# EAGLE design pk2c (EAGLE 5.11)
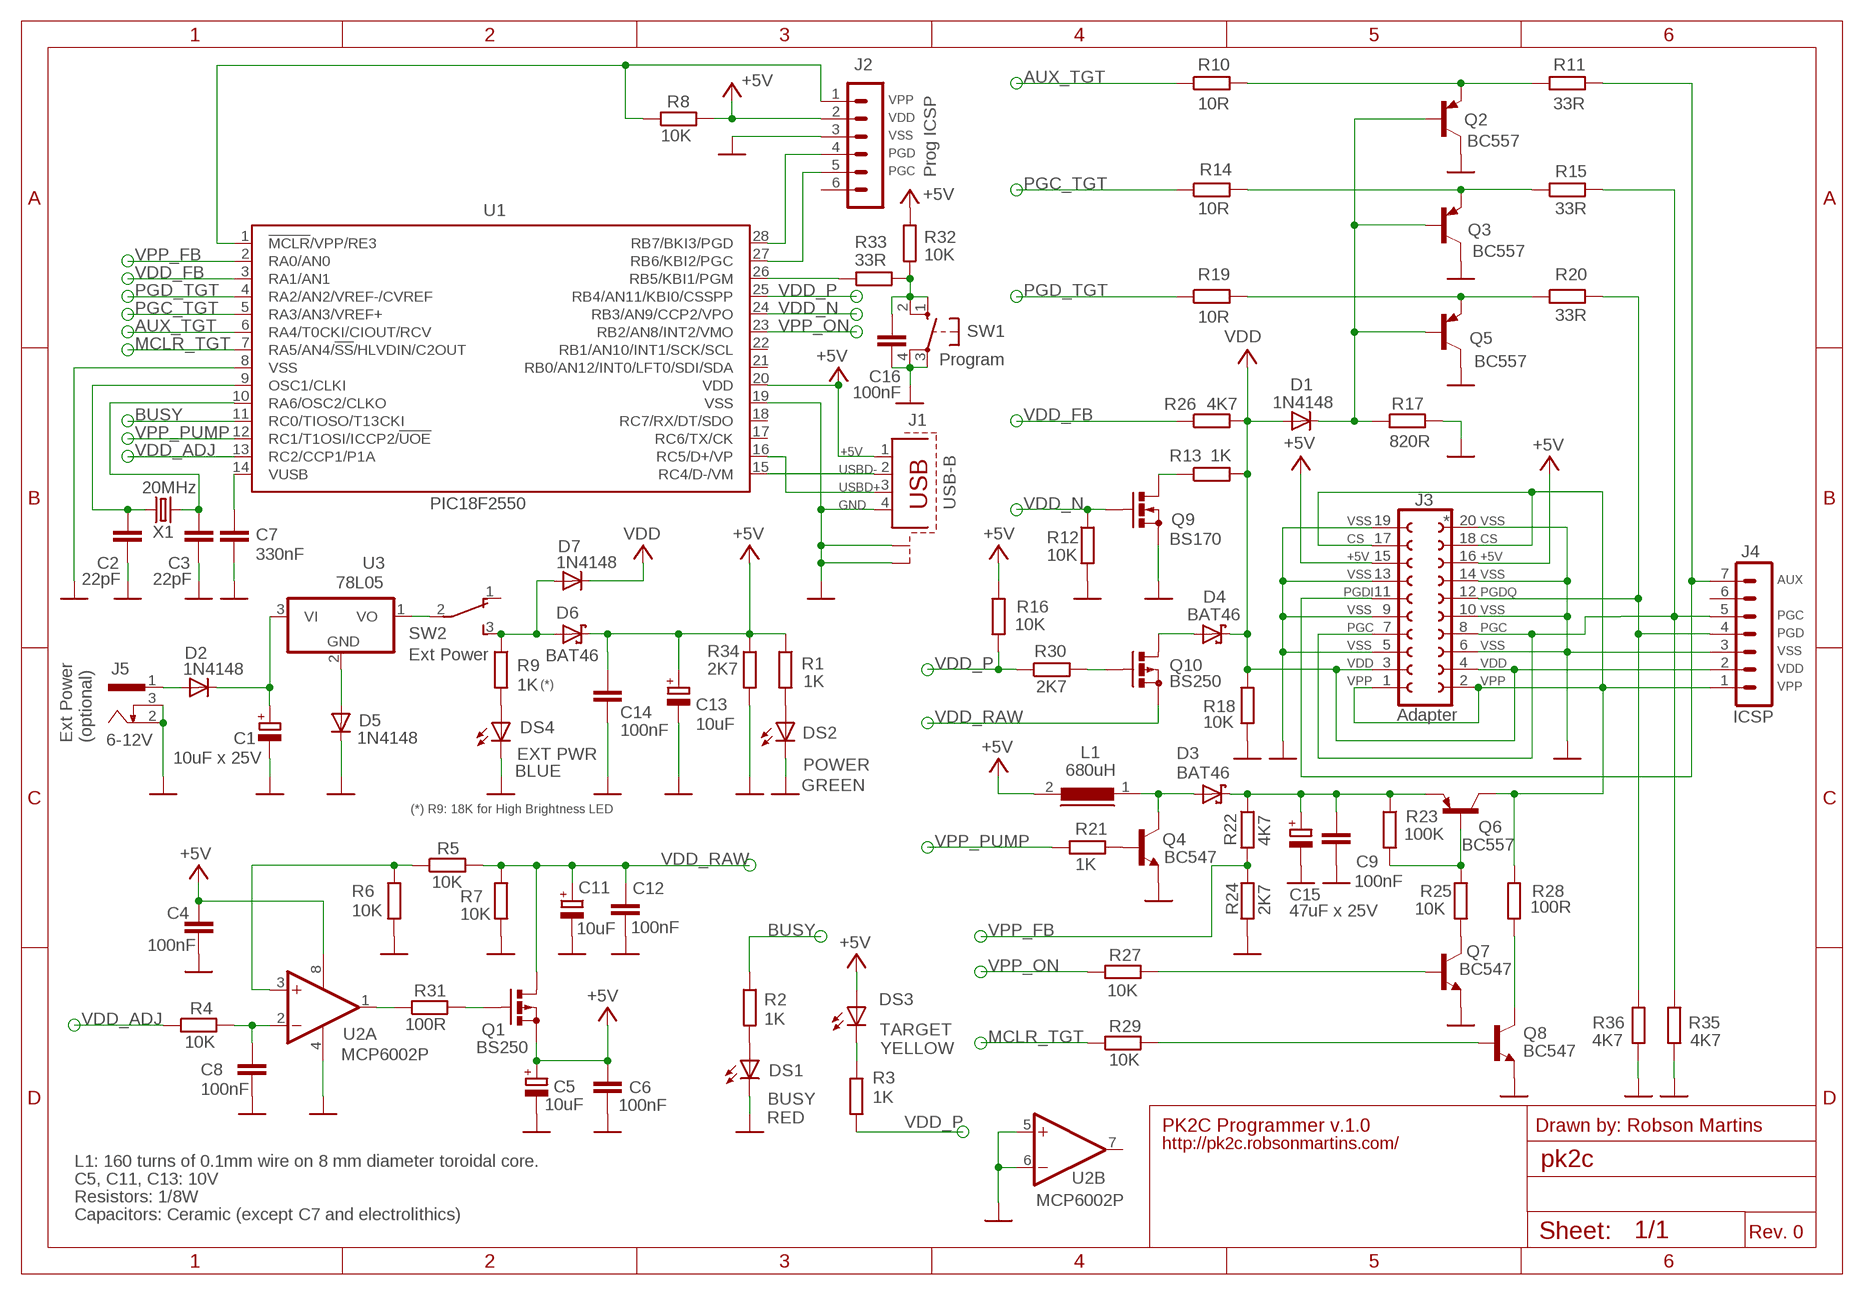
[diagram p0: schematic, sheet 1]

## Parts
C1  10uF x 25V  CPOL-EUE2,5-6E  [E2,5-6E]
C2  22pF  C-EU025-025X050  [C025-025X050]
C3  22pF  C-EU025-025X050  [C025-025X050]
C4  100nF  C-EU050-025X075  [C050-025X075]
C5  10uF  CPOL-EUE2,5-6E  [E2,5-6E]
C6  100nF  C-EU050-025X075  [C050-025X075]
C7  330nF  C-EU050-030X075  [C050-030X075]
C8  100nF  C-EU050-025X075  [C050-025X075]
C9  100nF  C-EU050-025X075  [C050-025X075]
C11  10uF  CPOL-EUE2,5-6E  [E2,5-6E]
C12  100nF  C-EU050-025X075  [C050-025X075]
C13  10uF  CPOL-EUE2,5-6E  [E2,5-6E]
C14  100nF  C-EU050-025X075  [C050-025X075]
C15  47uF x 25V  CPOL-EUE3.5-8  [E3,5-8]
C16  100nF  C-EU050-025X075  [C050-025X075]
D1  1N4148  1N4148DO35-7  [DO35-7]
D2  1N4148  1N4148DO35-7  [DO35-7]
D3  BAT46  BAT42  [DO35-7]
D4  BAT46  BAT42  [DO35-7]
D5  1N4148  1N4148DO35-7  [DO35-7]
D6  BAT46  BAT42  [DO35-7]
D7  1N4148  1N4148DO35-7  [DO35-7]
DS1  RED  LED3MM  [LED3MM]
DS2  GREEN  LED3MM  [LED3MM]
DS3  YELLOW  LED3MM  [LED3MM]
DS4  BLUE  LED3MM  [LED3MM]
J1  USB-B  PN61729-S  [PN61729-S]
J2  Prog ICSP  MA06-1  [MA06-1]
J3  Adapter  FE10-2  [FE10-2]
J4  ICSP  MA07-1  [MA07-1]
J5  6-12V  733980-62  [733980-62]
L1  680uH  A26GFC  [A26GFC]
Q1  BS250  [SOT54E]
Q2  BC557  [TO92]
Q3  BC557  [TO92]
Q4  BC547  [TO92]
Q5  BC557  [TO92]
Q6  BC557  [TO92]
Q7  BC547  [TO92]
Q8  BC547  [TO92]
Q9  BS170  [SOT54E]
Q10  BS250  [SOT54E]
R1  1K  R-EU_0204/7  [0204/7]
R2  1K  R-EU_0204/7  [0204/7]
R3  1K  R-EU_0204/7  [0204/7]
R4  10K  R-EU_0204/7  [0204/7]
R5  10K  R-EU_0204/7  [0204/7]
R6  10K  R-EU_0204/7  [0204/7]
R7  10K  R-EU_0204/7  [0204/7]
R8  10K  R-EU_0204/7  [0204/7]
R9  1K  R-EU_0204/7  [0204/7]
R10  10R  R-EU_0204/7  [0204/7]
R11  33R  R-EU_0204/7  [0204/7]
R12  10K  R-EU_0204/7  [0204/7]
R13  1K  R-EU_0204/7  [0204/7]
R14  10R  R-EU_0204/7  [0204/7]
R15  33R  R-EU_0204/7  [0204/7]
R16  10K  R-EU_0204/7  [0204/7]
R17  820R  R-EU_0204/7  [0204/7]
R18  10K  R-EU_0204/7  [0204/7]
R19  10R  R-EU_0204/7  [0204/7]
R20  33R  R-EU_0204/7  [0204/7]
R21  1K  R-EU_0204/7  [0204/7]
R22  4K7  R-EU_0204/7  [0204/7]
R23  100K  R-EU_0204/7  [0204/7]
R24  2K7  R-EU_0204/7  [0204/7]
R25  10K  R-EU_0204/7  [0204/7]
R26  4K7  R-EU_0204/7  [0204/7]
R27  10K  R-EU_0204/7  [0204/7]
R28  100R  R-EU_0204/7  [0204/7]
R29  10K  R-EU_0204/7  [0204/7]
R30  2K7  R-EU_0204/7  [0204/7]
R31  100R  R-EU_0204/7  [0204/7]
R32  10K  R-EU_0204/7  [0204/7]
R33  33R  R-EU_0204/7  [0204/7]
R34  2K7  R-EU_0204/7  [0204/7]
R35  4K7  R-EU_0204/7  [0204/7]
R36  4K7  R-EU_0204/7  [0204/7]
SW1  Program  10-XX  [B3F-10XX]
SW2  Ext Power  TL36PO  [TL3XPO]
U1  PIC18F2550  PIC18F2550_28DIP  [DIL28-3]
U2  MCP6002P  MCP602P  [DIL08]
U3  78L05  78L05Z  [TO92]
X1  20MHz  CRYSTALHC49U-V  [HC49U-V]

## Nets
+5V: C4.1 C5.+ C6.1 C13.+ C14.1 D6.C DS3.A J1.1 J2.2 J3.15 J3.16 L1.2 Q1.S R1.1 R8.2 R16.1 R32.1 R34.1 U1.20(VDD) U2.8(P:V+)
+EXT_PWR: D2.A J5.1
+EXT_PWR_5V: SW2.2(P) U3.1(VO)
+EXT_PWR_NR: C1.+ D2.C U3.3(VI)
+EXT_PWR_ON: D6.A D7.A R9.1 SW2.3(S)
AUX: J3.11 J4.7 R11.2
AUX_COMP: Q2.1(E) R10.2 R11.1
AUX_TGT: R10.1 U1.6(RA4/T0CKI/CIOUT/RCV)
BUSY: R2.1 U1.11(RC0/TIOSO/T13CKI)
CAP_VUSB: C7.1 U1.14(VUSB)
GND: C1.- C2.1 C3.1 C4.2 C5.- C6.2 C7.2 C8.2 C9.2 C11.- C12.2 C13.- C14.2 C15.- C16.2 D5.C DS1.K(C) DS2.K(C) DS4.K(C) J1.4 J1.S1 J1.S2 J2.3 J3.5 J3.6 J3.9 J3.10 J3.13 J3.14 J3.19 J3.20 J4.3 J5.2 J5.3 Q2.3(C) Q3.3(C) Q4.1(E) Q5.3(C) Q7.1(E) Q8.1(E) Q9.S R6.2 R7.2 R12.2 R17.2 R18.2 R24.2 R34.2 R35.2 R36.2 SW1.3(P) SW1.4(P1) U1.8(VSS) U1.19(VSS) U2.4(P:V-) U2.5(B:+IN) U2.6(B:-IN)
ICSP_PGC: J2.5 U1.27(RB6/KBI2/PGC)
ICSP_PGD: J2.4 U1.28(RB7/BKI3/PGD)
ICSP_VPP: J2.1 R8.1 U1.1(!MCLR!/VPP/RE3)
MCLR_TGT: R29.1 U1.7(RA5/AN4/!SS!/HLVDIN/C2OUT)
N$1: D5.A U3.2(GND)
N$3: C16.1 R32.2 R33.2 SW1.1(S) SW1.2(S1)
N$5: DS4.A R9.2
N$10: DS2.A R1.2
N$11: DS1.A R2.2
N$12: DS3.K(C) R3.1
N$15: R31.1 U2.1(A:OUT)
N$17: Q1.G R31.2
N$18: Q7.3(C) R25.2
N$22: Q9.D R13.1
N$23: D4.A Q10.D
N$25: Q10.G R30.2
N$29: Q4.2(B) R21.2
N$31: Q6.2(B) R23.2 R25.1
N$33: Q8.3(C) R28.2
N$34: Q7.2(B) R27.2
N$36: Q8.2(B) R29.2
OSC1: C2.2 U1.9(OSC1/CLKI) X1.1
OSC2: C3.2 U1.10(RA6/OSC2/CLKO) X1.2
PGC: J3.7 J3.8 J4.5 R15.2 R35.1
PGC_COMP: Q3.1(E) R14.2 R15.1
PGC_TGT: R14.1 U1.5(RA3/AN3/VREF+)
PGD: J3.12 J4.4 R20.2 R36.1
PGD_COMP: Q5.1(E) R19.2 R20.1
PGD_TGT: R19.1 U1.4(RA2/AN2/VREF-/CVREF)
SW_PROGRAM: R33.1 U1.26(RB5/KBI1/PGM)
USBD+: J1.3 U1.16(RC5/D+/VP)
USBD-: J1.2 U1.15(RC4/D-/VM)
VDD: D1.A D4.C D7.C J3.3 J3.4 J4.2 R13.2 R18.1 R26.2
VDD_ADJ: R4.1 U1.13(RC2/CCP1/P1A)
VDD_COMP: D1.C Q2.2(B) Q3.2(B) Q5.2(B) R17.1
VDD_FB: R26.1 U1.3(RA1/AN1)
VDD_N: Q9.G R12.1 U1.24(RB3/AN9/CCP2/VPO)
VDD_P: R3.2 R16.2 R30.1 U1.25(RB4/AN11/KBI0/CSSPP)
VDD_RAW: C11.+ C12.1 Q1.D Q10.S R5.2 R7.1
VDD_RAW_FB: R5.1 R6.1 U2.3(A:+IN)
VDD_RAW_REF: C8.1 R4.2 U2.2(A:-IN)
VPP: J3.1 J3.2 J3.17 J3.18 J4.1 Q6.3(C) R28.1
VPP_FB: R22.2 R24.1 U1.2(RA0/AN0)
VPP_ON: R27.1 U1.23(RB2/AN8/INT2/VMO)
VPP_PUMP: R21.1 U1.12(RC1/T1OSI/ICCP2/!UOE)
VPP_PUMP_SW: D3.A L1.1 Q4.3(C)
VPP_RAW: C9.1 C15.+ D3.C Q6.1(E) R22.1 R23.1
Unconnected: J2.6 J4.6 SW2.1(O) U1.17(RC6/TX/CK) U1.18(RC7/RX/DT/SDO) U1.21(RB0/AN12/INT0/LFT0/SDI/SDA) U1.22(RB1/AN10/INT1/SCK/SCL) U2.7(B:OUT)

## Notes on the sheet
- VPP
- VDD
- VSS
- PGD
- PGC
- VSS | * | VSS
- CS | CS
- +5V | +5V
- VSS | VSS
- AUX
- PGDI | PGDQ
- VSS | VSS
- PGC
- PGC | PGC
- PGD
- VSS | VSS
- VSS
- VDD | VDD
- VDD
- (*) | VPP | VPP
- VPP
- Ext Power | (optional)
- EXT PWR
- POWER
- (*) R9: 18K for High Brightness LED
- TARGET
- BUSY
- PK2C Programmer v.1.0 | Drawn by: Robson Martins
- http://pk2c.robsonmartins.com/
- L1: 160 turns of 0.1mm wire on 8 mm diameter toroidal core.
- C5, C11, C13: 10V
- Resistors: 1/8W
- Capacitors: Ceramic (except C7 and electrolithics)
- Rev. 0

## Library data of the parts
C1 C5 C11 C13 C15 = rcl:CPOL-EU: POLARIZED CAPACITOR, European symbol
C2-C4 C6-C9 C12 C14 C16 = rcl:C-EU: CAPACITOR, European symbol
D1 D2 D5 D7 = diode:1N4148: DIODE high speed (Philips)
D3 D4 D6 = diode:BAT42: DIODE barrier diode
DS1-DS4 = led:LED: LED OSRAM: - CHIPLED LG R971, LG N971, LY N971, LG Q971, LY Q971, LO R971, LY R971 LH N974, LH R974 LS Q976, LO Q976, LY Q976 LO Q996 - Hyper CHIPLED LW Q18S LB Q993, LB Q99A, LB R99A - SideLED LS A670, LO A670, LY A670, LG A670, LP A670 LB A673, LV A673, LT A673, LW A673 LH A674 LY A675 LS A676, LA A676, LO A676, LY A676, LW A676 LS A679, LY A679, LG A679 - Hyper Micro SIDELED® LS Y876, LA Y876, LO Y876, LY Y876 LT Y87S - SmartLED LW L88C, LW L88S LB L89C, LB L89S, LG L890 LS L89K, LO L89K, LY L89K LS L896, LA L896, LO L896, LY L896 - TOPLED LS T670, LO T670, LY T670, LG T670, LP T670 LSG T670, LSP T670, LSY T670, LOP T670, LYG T670 LG T671, LOG T671, LSG T671 LB T673, LV T673, LT T673, LW T673 LH T674 LS T676, LA T676, LO T676, LY T676, LB T676, LH T676, LSB T676, LW T676 LB T67C, LV T67C, LT T67C, LS T67K, LO T67K, LY T67K, LW E67C LS E67B, LA E67B, LO E67B, LY E67B, LB E67C, LV E67C, LT E67C LW T67C LS T679, LY T679, LG T679 LS T770, LO T770, LY T770, LG T770, LP T770 LB T773, LV T773, LT T773, LW T773 LH T774 LS E675, LA E675, LY E675, LS T675 LS T776, LA T776, LO T776, LY T776, LB T776 LHGB T686 LT T68C, LB T68C - Hyper Mini TOPLED® LB M676 - Mini TOPLED Santana® LG M470 LS M47K, LO M47K, LY M47K Source: http://www.osram.convergy.de LUXEON: - LUMILED® LXK2-PW12-R00, LXK2-PW12-S00, LXK2-PW14-U00, LXK2-PW14-V00 LXK2-PM12-R00, LXK2-PM12-S00, LXK2-PM14-U00 LXK2-PE12-Q00, LXK2-PE12-R00, LXK2-PE12-S00, LXK2-PE14-T00, LXK2-PE14-U00 LXK2-PB12-K00, LXK2-PB12-L00, LXK2-PB12-M00, LXK2-PB14-N00, LXK2-PB14-P00, LXK2-PB14-Q00 LXK2-PR12-L00, LXK2-PR12-M00, LXK2-PR14-Q00, LXK2-PR14-R00 LXK2-PD12-Q00, LXK2-PD12-R00, LXK2-PD12-S00 LXK2-PH12-R00, LXK2-PH12-S00 LXK2-PL12-P00, LXK2-PL12-Q00, LXK2-PL12-R00 Source: www.luxeon.com KINGBRIGHT: KA-3528ASYC Source: www.kingbright.com
J1 = con-berg:PN61729-S: BERG USB connector; OC_FARNELL: unknown; OC_NEWARK: unknown
J2 = con-lstb:MA06-1: PIN HEADER; OC_FARNELL: unknown; OC_NEWARK: unknown
J3 = con-lsta:FE10-2: FEMALE HEADER; OC_FARNELL: unknown; OC_NEWARK: unknown
J4 = con-lstb:MA07-1: PIN HEADER; OC_FARNELL: unknown; OC_NEWARK: unknown
J5 = con-conrad:73398?: FEMALE PRINT CONNECTOR Niedervolt-Steckverbinder Distributor Conrad
L1 = inductors:A26GFC: INDUCTOR
Q1 Q10 = transistor-small-signal:BS250: P-CHANNEL MOS FET
Q2 Q3 Q5 Q6 = transistor-pnp:BC557: PNP Transistor
Q4 Q7 Q8 = transistor:BC547: NPN TRANSISTOR
Q9 = transistor-small-signal:BS170: N-CHANNEL MOS FET
R1-R36 = resistor:R-EU_: RESISTOR, European symbol
SW1 = switch-omron:10-XX: OMRON SWITCH; MPN: B3F-1000; OC_FARNELL: 176432; OC_NEWARK: 36M3542
SW2 = switch:TL36PO: TINY SWITCH ON - ON Source: http://www2.produktinfo.conrad.com/datenblaetter/700000-724999/705152-da-01-de-Subminiaturschalter_TL_36YO.pdf
U1 = microchip:PIC18F2*_28: USB Microcontrollers with nanoWatt Technology High-Performance, Enhanced Flash, 28/40/44-Pin, Source: http://ww1.microchip.com/downloads/en/devicedoc/39632c.pdf; MF: MICROCHIP; MPN: PIC18F2550-I/SP; OC_FARNELL: 1523822; OC_NEWARK: 80K6054
U2 = linear:MCP602: Single Op Amp 2.7V to 6.0V Single Supply CMOS Source: http://ww1.microchip.com/downloads/en/DeviceDoc/21314g.pdf
U3 = linear:78*: Positive VOLTAGE REGULATOR Source: http://cache.national.com/ds/LM/LM78L05.pdf http://www.fairchildsemi.com/ds/LM/LM7805.pdf
X1 = crystal:CRYSTAL: CRYSTAL; OC_FARNELL: 1666969; OC_NEWARK: unknown

## Board
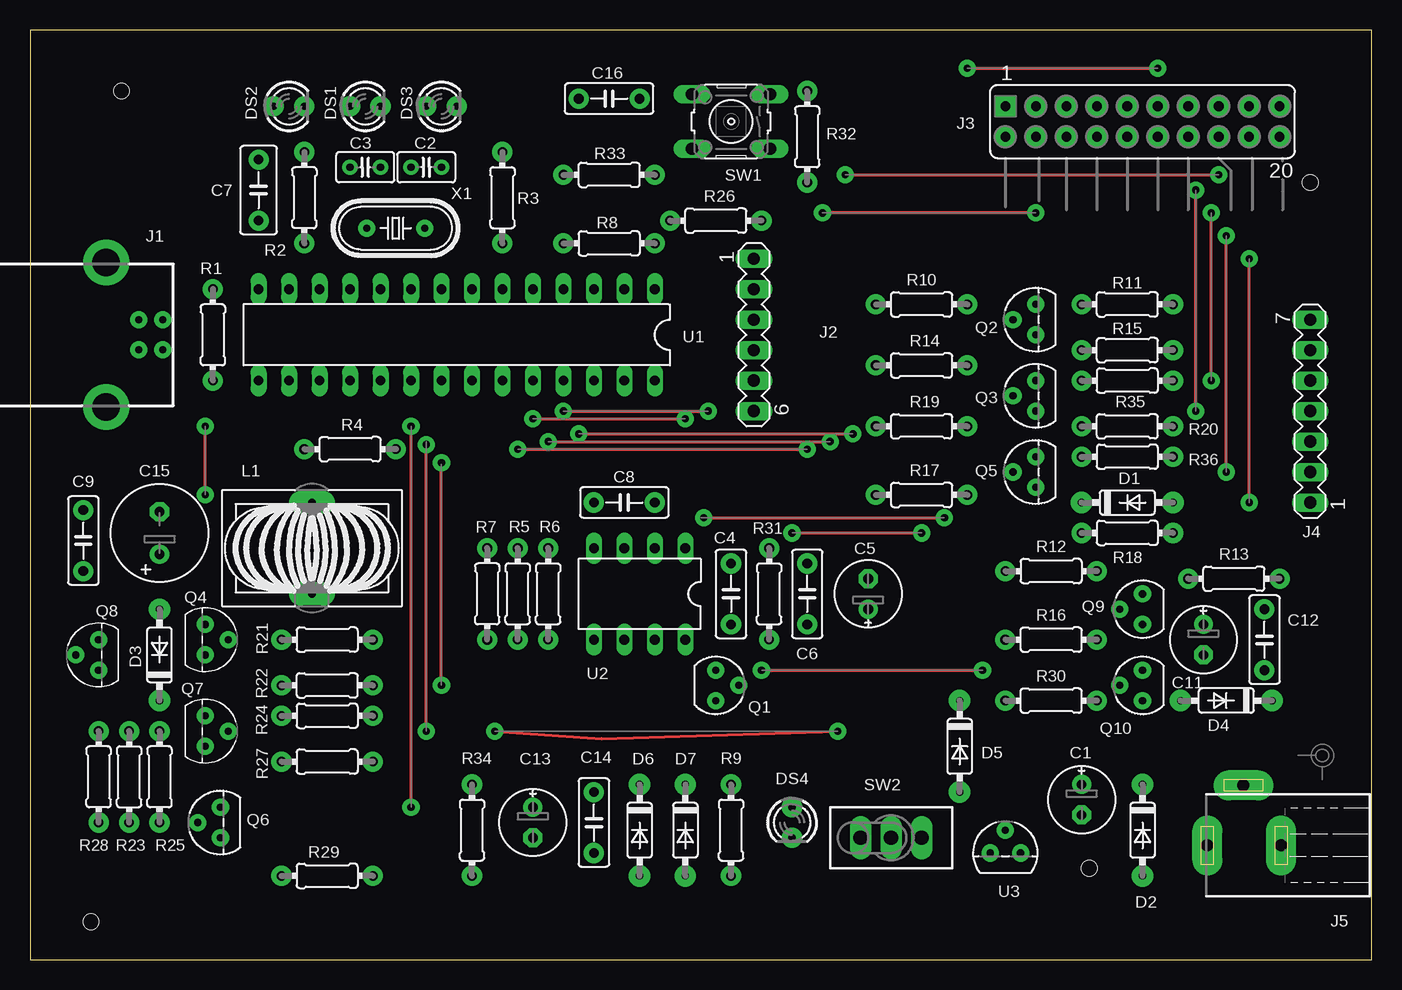
[diagram p1: board, top side]
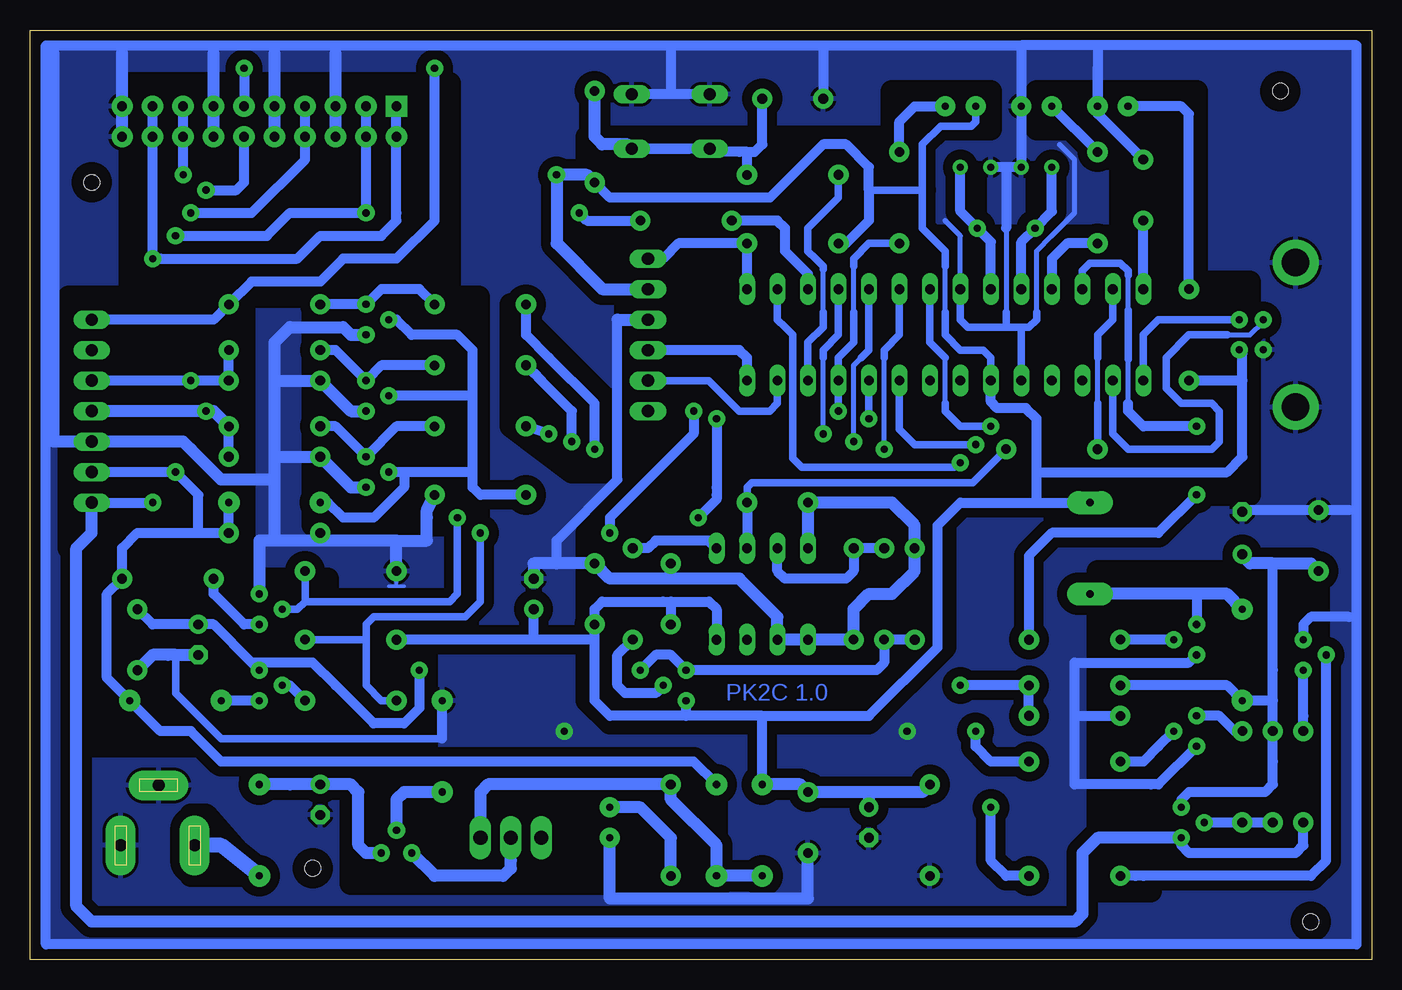
[diagram p2: board, bottom side, seen from below]

Size 111.82 x 77.48 mm. Coordinates in mm from the lower left corner, seen from the top.
Outline: 0,0 111.82,0.01 111.82,77.47 0,77.47 0,0
Copper layers (1*16): Top 0.035mm / dielectric 1.5mm / Bottom 0.035mm
Design rules "default": minimum track width 10mil, minimum drill 24mil, track to track 8mil, track to pad 8mil, pad to pad 8mil, via to via 8mil, smd to smd 8mil, copper to edge 40mil, drill to drill 8mil, minimum pad ring 10mil, minimum via ring 8mil, stop-mask expansion 4mil, vias tented up to drill 0mil, thermal gap 10mil
Holes 1.3 mm at 7.62,72.39 106.68,64.77 5.08,3.17 88.27,7.62
bRestrict: area 74.4,36.2 to 88.3,55.2; area 94,31.8 to 108.6,55.2; area 4.4,5.7 to 22.9,32.4; area 35.6,19.7 to 65.4,39.4; area 54.6,6.3 to 85.1,14; area 78.7,17.8 to 108,31.8; area 10.2,38.7 to 65.4,72.4; area 76.8,55.2 to 103.5,73; area 92.7,7 to 98.4,12.1; area 63.5,40.6 to 71.8,54.6

### Footprints (pad centres in the part's own frame; a part is rotated, then mirrored left to right if it is on the bottom)
E2,5-6E = drill 0.813 pad 1.575 round: + -1.27,0 | drill 0.813 pad 1.575 octagon: - 1.27,0
C025-025X050 = drill 0.6 pad 1.27 round: 1 -1.27,0; 2 1.27,0
C050-025X075 = drill 0.813 pad 1.676 round: 1 -2.54,0; 2 2.54,0
C050-030X075 = drill 0.813 pad 1.676 round: 1 -2.54,0; 2 2.54,0
E3,5-8 = drill 0.813 pad 1.6 round: + -1.778,0 | drill 0.813 pad 1.6 octagon: - 1.778,0
DO35-7 = drill 0.6 pad 1.778 round: A 3.81,0; C -3.81,0
LED3MM = drill 0.6 pad 1.676 round: A -1.27,0; K 1.27,0
PN61729-S = drill 0.6 pad 1.422 round: 1 1.25,4.71; 2 -1.25,4.71; 3 -1.25,2.71; 4 1.25,2.71 | drill 2.3 pad 3.81 round: S1 -6.02,0; S2 6.02,0
MA06-1 = drill 1.016 long: 1 -6.35,0; 2 -3.81,0; 3 -1.27,0; 4 1.27,0; 5 3.81,0; 6 6.35,0
FE10-2 = drill 0.8 pad 1.778 square: 1 -11.43,1.27 | drill 0.8 pad 1.778 round: 2 -11.43,-1.27; 3 -8.89,1.27; 4 -8.89,-1.27; 5 -6.35,1.27; 6 -6.35,-1.27; 7 -3.81,1.27; 8 -3.81,-1.27; 9 -1.27,1.27; 10 -1.27,-1.27; 11 1.27,1.27; 12 1.27,-1.27; 13 3.81,1.27; 14 3.81,-1.27; 15 6.35,1.27; 16 6.35,-1.27; 17 8.89,1.27; 18 8.89,-1.27; 19 11.43,1.27; 20 11.43,-1.27
MA07-1 = drill 1.016 long: 1 -7.62,0; 2 -5.08,0; 3 -2.54,0; 4 0,0; 5 2.54,0; 6 5.08,0; 7 7.62,0
733980-62 = drill 1 pad 2.5 long: 1 0,8.57; 2 0,2.42; 3 5,5.57
A26GFC = drill 0.6 pad 1.93 long: 1 0,3.81; 2 0,-3.81
SOT54E = drill 0.6 pad 1.422 round: D -1.27,0; G 0,1.905; S 1.27,0
TO92 = drill 0.6 pad 1.422 round: 1 1.27,0; 2 0,1.905; 3 -1.27,0
0204/7 = drill 0.813 pad 1.676 round: 1 -3.81,0 | drill 0.8 pad 1.676 round: 2 3.81,0
B3F-10XX = drill 1.016 long: 1 -3.251,2.261; 2 3.251,2.261; 3 -3.251,-2.261; 4 3.251,-2.261
TL3XPO = drill 1.2 pad 1.27 long: 1 -2.54,0; 2 0,0; 3 2.54,0
DIL28-3 = drill 0.813 long: 1 -16.51,-3.81; 2 -13.97,-3.81; 3 -11.43,-3.81; 4 -8.89,-3.81; 5 -6.35,-3.81; 6 -3.81,-3.81; 7 -1.27,-3.81; 8 1.27,-3.81; 9 3.81,-3.81; 10 6.35,-3.81; 11 8.89,-3.81; 12 11.43,-3.81; 13 13.97,-3.81; 14 16.51,-3.81; 15 16.51,3.81; 16 13.97,3.81; 17 11.43,3.81; 18 8.89,3.81; 19 6.35,3.81; 20 3.81,3.81; 21 1.27,3.81; 22 -1.27,3.81; 23 -3.81,3.81; 24 -6.35,3.81; 25 -8.89,3.81; 26 -11.43,3.81; 27 -13.97,3.81; 28 -16.51,3.81
DIL08 = drill 0.813 long: 1 -3.81,-3.81; 2 -1.27,-3.81; 3 1.27,-3.81; 4 3.81,-3.81; 5 3.81,3.81; 6 1.27,3.81; 7 -1.27,3.81; 8 -3.81,3.81
TO92' = drill 0.6 pad 1.422 round: 1 -1.27,0; 2 0,1.905; 3 1.27,0
HC49U-V = drill 0.6 pad 1.422 round: 1 -2.413,0; 2 2.413,0

### Placement (x,y rotation side)
C1  87.63,13.34 270 top
C2  33.02,66.04 0 top
C3  27.94,66.04 180 top
C4  58.42,30.48 90 top
C5  69.85,30.48 90 top
C6  64.77,30.48 90 top
C7  19.05,64.14 90 top
C8  49.53,38.1 180 top
C9  4.45,34.92 90 top
C11  97.79,26.67 270 top
C12  102.87,26.67 270 top
C13  41.91,11.43 270 top
C14  46.99,11.43 270 top
C15  10.79,35.56 90 top
C16  48.26,71.75 180 top
D1  91.44,38.1 0 top
D2  92.71,10.79 270 top
D3  10.79,25.4 90 top
D4  99.69,21.59 180 top
D5  77.47,17.78 270 top
D6  50.8,10.79 270 top
D7  54.61,10.79 270 top
DS1  27.94,71.12 0 top
DS2  21.59,71.12 0 top
DS3  34.29,71.12 0 top
DS4  63.5,11.43 270 top
J1  6.35,52.07 270 top
J2  60.33,52.07 270 top
J3  92.71,69.85 0 top
J4  106.68,45.72 90 top
J5  106.68,9.53 90 top
L1  23.5,34.29 180 top
Q1  57.15,22.86 270 top
Q2  83.82,53.34 90 top
Q3  83.82,46.99 90 top
Q4  14.61,26.67 270 top
Q5  83.82,40.64 90 top
Q6  15.88,11.43 90 top
Q7  14.61,19.05 270 top
Q8  5.71,25.4 90 top
Q9  92.71,29.21 90 top
Q10  92.71,22.86 90 top
R1  15.24,52.07 90 top
R2  22.86,63.5 90 top
R3  39.37,63.5 270 top
R4  26.67,42.55 0 top
R5  40.64,30.48 270 top
R6  43.18,30.48 270 top
R7  38.1,30.48 90 top
R8  48.26,59.69 180 top
R9  58.42,10.79 270 top
R10  74.3,54.61 0 top
R11  91.44,54.61 0 top
R12  85.09,32.38 180 top
R13  100.33,31.75 0 top
R14  74.3,49.53 0 top
R15  91.44,50.8 0 top
R16  85.09,26.67 0 top
R17  74.3,38.73 0 top
R18  91.44,35.56 180 top
R19  74.3,44.45 0 top
R20  91.44,44.45 0 top
R21  24.77,26.67 180 top
R22  24.77,22.86 0 top
R23  8.26,15.24 270 top
R24  24.77,20.32 180 top
R25  10.79,15.24 90 top
R26  57.15,61.59 0 top
R27  24.77,16.51 180 top
R28  5.71,15.24 90 top
R29  24.77,6.99 180 top
R30  85.09,21.59 0 top
R31  61.59,30.48 270 top
R32  64.77,68.58 90 top
R33  48.26,65.41 0 top
R34  36.83,10.79 270 top
R35  91.44,48.26 180 top
R36  91.44,41.91 180 top
SW1  58.42,69.85 180 top
SW2  71.75,10.16 0 top
U1  35.56,52.07 180 top
U2  50.8,30.48 180 top
U3  78L05  [TO92']  81.28,8.89 0 top
X1  30.48,60.96 180 top

### Tracks (layer width: path | path; a pad name or v marks a point on that pad's centre or on a via)
+5V  (via drill 0.6 pad 1.42)
  Top 0.254: v67.94,65.41 v99.06,65.41
  Bottom 0.406: 35.56,53.98 35.56,57.78
  Bottom 0.61: U1.20 31.75,50.16 32.38,50.8 34.29,50.8 35.56,52.07 35.56,53.98 | 35.56,57.78 35.56,59.05 37.47,60.96 37.47,64.14 | 37.47,64.14 41.91,64.14 | 37.47,64.14 37.47,67.94 35.94,69.47 33.4,69.47 33.02,69.85 DS3.A
  Bottom 0.813: 64.77,26.67 C6.1 64.77,29.21 64.14,29.84 59.05,29.84 58.42,29.84 | 58.42,29.84 C4.1 | U2.8 54.61,29.21 55.24,29.84 58.42,29.84 | 57.15,20.32 Q1.S | 57.15,20.32 63.5,20.32 64.77,21.59 64.77,26.67 | 64.77,26.67 69.85,26.67 | 69.85,26.67 R16.1 | 10.79,48.26 10.79,50.55 J1.1 | 10.79,48.26 R1.1 | J3.15 J3.16 v99.06,65.41 | 27.94,40.64 27.94,45.09 28.83,45.97 31.24,45.97 31.75,46.48 U1.20 | 10.79,48.26 10.79,41.91 12.06,40.64 27.94,40.64 | 69.85,26.67 C5.+ | 27.94,38.1 27.94,40.64 | 27.94,38.1 34.29,38.1 36.2,36.2 36.2,26.04 41.91,20.32 50.8,20.32 | 50.8,20.32 57.15,20.32 | D6.C 50.8,20.32 | R32.1 63.5,63.5 50.16,63.5 45.72,67.94 43.81,67.94 41.91,66.04 41.91,64.14 41.91,62.87 41.91,62.23 41.91,61.59 43.81,59.69 R8.2 | 27.94,38.1 L1.2
  Bottom 1.016: D6.C 47.62,14.61 C14.1 41.91,13.97 | 41.91,13.97 37.47,13.97 R34.1 | 41.91,13.97 C13.+ | R32.1 65.41,65.41 v67.94,65.41 67.94,59.69 64.14,55.88 J2.2
+EXT_PWR
  Bottom 1.27: J5.1 95.89,9.53 D2.A
+EXT_PWR_5V
  Bottom 1.016: U3.1 78.11,6.99 72.39,6.99 71.75,7.62 71.75,8.26 SW2.2
+EXT_PWR_NR
  Bottom 1.016: D2.C 90.17,14.61 C1.+ 85.09,14.61 84.45,13.97 84.45,9.53 83.82,8.89 U3.3
+EXT_PWR_ON
  Bottom 1.016: D6.A D7.A 54.61,9.53 58.42,13.34 R9.1 73.66,14.61 74.3,13.97 SW2.3
AUX  (via drill 0.6 pad 1.42)
  Top 0.254: v78.11,74.3 v93.98,74.3
  Bottom 0.813: J4.7 96.52,53.34 R11.2 93.34,56.52 87.63,56.52 85.72,58.42 81.28,58.42 78.11,61.59 78.11,72.39 v78.11,74.3 | v93.98,74.3 J3.11
AUX_COMP
  Bottom 0.813: R11.1 Q2.1 82.55,55.88 80.64,55.88 79.38,55.88 R10.2
AUX_TGT  (via drill 0.6 pad 1.42)
  Top 0.254: v40.64,42.55 v64.77,42.55
  Bottom 0.406: 40.64,50.16 40.64,46.99 40.64,45.72 v40.64,42.55
  Bottom 0.61: U1.6 39.37,52.07 40.64,50.8 40.64,50.16
  Bottom 0.813: R10.1 70.48,52.07 68.58,50.16 64.77,46.35 v64.77,42.55
BUSY
  Bottom 0.813: U1.11 26.67,58.42 25.4,59.69 R2.1
CAP_VUSB
  Bottom 0.813: U1.14 C7.1
GND  (via drill 0.6 pad 1.42)
  Top 0.254: v67.31,19.05 47.62,18.41 v38.73,19.05
  Bottom 0.305: 81.28,31.11 81.92,31.11 | 80.64,31.11 81.28,31.11 | 81.28,31.11 R12.2
  Bottom 0.406: 30.48,60.96 30.48,53.98 | 27.94,54.61 27.94,53.98 27.94,54.61 | 27.94,54.61 27.94,59.05 26.67,60.33 24.77,62.23 24.77,66.67 26.04,67.94 | U1.8 34.29,60.33 35.56,61.59 | 1.91,28.57 1.27,28.57 1.27,27.94 | 1.91,37.47 1.27,37.47 1.27,38.1
  Bottom 0.61: U1.19 29.21,51.44 29.21,52.7 | 30.48,52.7 33.66,52.7 34.29,53.34 U1.8 | 30.48,53.98 30.48,52.7 | 77.47,18.41 95.89,18.41 97.16,19.68 99.69,22.23 99.69,25.4 | 29.21,52.7 28.57,52.7 27.94,53.34 27.94,53.98 | 30.48,52.7 29.21,52.7
  Bottom 0.813: Q4.1 15.24,24.77 24.77,24.77 24.77,20.32 | 24.77,20.32 24.77,14.61 18.41,14.61 17.78,14.61 Q7.1 | Q8.1 5.71,27.94 5.08,28.57 1.91,28.57 | 24.77,20.32 R24.2 | 1.91,37.47 C9.2 10.67,37.47 C15.- | 22.86,70.48 DS2.K 22.86,74.3 | 22.86,70.48 19.68,67.31 C7.2 | 30.48,66.04 C3.1 29.21,69.22 DS1.K 29.21,74.3 29.21,76.2 | 30.48,66.04 C2.1 | 30.48,66.04 30.48,60.96 | 77.47,18.41 D5.C | 62.87,53.34 62.87,40.01 67.94,34.92 67.94,33.02 | 22.86,76.2 1.27,76.2 1.27,38.1 1.27,27.94 1.27,1.27 110.49,1.27 110.49,76.2 58.42,76.2 | 22.86,76.2 29.21,76.2 | 58.42,76.2 45.72,76.2 | 45.72,76.2 29.21,76.2 | 22.86,76.2 22.86,70.48 | 45.72,76.2 C16.2 | SW1.4 SW1.3 | 58.42,76.2 58.42,72.39
  Bottom 1.016: R17.2 78.74,37.47 78.74,36.83 78.74,34.92 | 90.17,41.91 R36.2 | Q3.3 85.09,45.72 R35.2 91.44,48.26 | 85.09,39.37 Q5.3 | R36.2 85.09,39.37 | 85.09,39.37 Q5.3 | R36.2 85.09,39.37 | 90.17,41.91 R36.2 | Q2.3 85.09,52.07 85.72,52.7 90.17,52.7 91.44,51.44 91.44,48.26 | 85.09,39.37 Q5.3 | R36.2 85.09,39.37 | 91.44,41.91 91.44,48.26 | 91.44,41.91 90.17,41.91 | 91.44,40.01 91.44,36.83 91.44,35.56 91.44,34.92 | 91.44,40.01 91.44,41.91 | 58.42,31.75 C4.2 | 58.42,31.75 60.33,31.75 | 60.33,31.75 62.87,31.75 63.5,31.75 C6.2 67.94,33.02 69.85,33.02 C5.- | 58.42,31.75 52.7,31.75 49.53,28.57 U2.6 U2.5 R6.2 43.18,29.21 41.91,30.48 40.01,30.48 38.1,32.38 R7.2 38.1,36.2 40.01,38.1 C8.2 U2.4 | 58.42,31.75 60.33,31.75 | C11.- 99.69,25.4 100.33,25.4 101.6,25.4 C12.2 | Q9.S 92.71,32.38 92.71,33.02 92.71,34.92 91.44,34.92 | R12.2 81.28,33.02 81.28,34.92 | 81.28,34.92 78.74,34.92 | 81.28,34.92 78.74,34.92 | J3.20 J3.19 104.14,74.3 104.14,75.56 | J3.6 J3.5 86.36,75.56 | J3.14 J3.13 96.52,74.3 96.52,75.56 | J3.10 J3.9 91.44,74.3 91.44,75.56 | 109.86,75.56 109.86,43.18 J4.3 99.06,43.18 98.42,42.55 95.89,40.01 91.44,40.01 | DS4.K 63.5,5.08 46.99,5.08 C14.2 | 81.28,34.92 87.63,34.92 | 87.63,34.92 91.44,34.92 | 87.63,34.92 R18.2 | 62.87,53.34 J2.3
  pour Bottom (isolate 0.813): 0,77.47 0,0 111.76,0 111.76,77.47
ICSP_PGC
  Bottom 0.61: J2.5 55.24,48.26 52.7,45.72 50.16,45.72 49.53,46.35 U1.27
ICSP_PGD
  Bottom 0.813: U1.28 52.07,50.16 52.7,50.8 J2.4
ICSP_VPP
  Bottom 0.813: J2.1 59.05,58.42 57.78,59.69 R8.1 U1.1
MCLR_TGT  (via drill 0.6 pad 1.42)
  Top 0.254: v31.75,12.7 v31.75,44.45
  Bottom 0.406: 35.56,46.35 35.56,50.16
  Bottom 0.61: U1.7 36.83,51.44 35.56,50.16 | v31.75,44.45 34.29,44.45 35.56,45.72 35.56,46.35
  Bottom 0.813: R29.1 30.48,6.99 31.75,8.26 v31.75,12.7
N$1
  Bottom 1.016: U3.2 81.28,13.34 80.64,13.97 D5.A
N$3
  Bottom 0.813: 56.79,67.59 SW1.1 SW1.2 54.89,67.31 52.7,67.31 52.07,67.31 | C16.1 50.8,67.94 51.44,67.31 52.07,67.31 | R33.2 52.07,67.31
  Bottom 1.016: R32.2 64.77,68.58 64.14,67.94 62.03,67.94 SW1.1 | 54.89,67.31 SW1.2
N$5
  Bottom 1.016: DS4.A 60.96,12.7 58.42,10.16 R9.2
N$10
  Bottom 0.813: R1.2 15.24,70.48 15.88,71.12 DS2.A
N$11
  Bottom 0.813: R2.2 DS1.A
N$12
  Bottom 0.813: DS3.K 37.47,71.12 38.1,71.12 39.37,69.85 R3.1
N$15
  Bottom 0.813: R31.1 60.33,34.29 59.69,34.92 55.24,34.92 U2.1
N$17
  Bottom 0.813: R31.2 62.87,25.4 62.87,22.86 62.23,22.23 59.69,22.23 Q1.G
N$18
  Bottom 0.813: R25.2 11.43,19.05 12.7,20.32 Q7.3
N$22
  Bottom 0.813: Q9.D 93.98,27.94 96.52,30.48 R13.1
N$23
  Bottom 0.813: Q10.D D4.A
N$25
  Bottom 0.813: Q10.G 90.17,22.86 R30.2
N$29
  Bottom 0.813: R21.2 18.41,26.67 Q4.2
N$31
  Bottom 0.813: R23.2 R25.1 12.7,11.43 Q6.2
N$33
  Bottom 0.813: Q8.3 5.71,20.32 R28.2
N$34
  Bottom 0.813: R27.2 19.05,16.51 17.78,17.78 Q7.2
N$36
  Bottom 0.813: R29.2 19.68,6.99 19.05,6.99 5.08,6.99 3.81,8.26 3.81,24.77 Q8.2
OSC1
  Bottom 0.813: U1.9 31.75,59.82 X1.1 34.29,62.36 C2.2
OSC2
  Bottom 0.813: U1.10 29.21,59.82 X1.2 26.67,62.36 C3.2
PGC  (via drill 0.6 pad 1.42)
  Top 0.254: v98.42,48.26 v98.42,62.23
  Bottom 0.813: R15.2 R35.1 v98.42,48.26 J4.5 | J3.7 J3.8 88.9,66.67 93.34,62.23 v98.42,62.23
PGC_COMP
  Bottom 0.813: R15.1 86.36,50.8 Q3.1 82.55,49.53 R14.2
PGC_TGT  (via drill 0.6 pad 1.42)
  Top 0.254: v43.18,43.18 v66.67,43.18
  Bottom 0.406: 42.55,50.16 43.18,49.53 43.18,46.99 43.18,45.72 v43.18,43.18
  Bottom 0.61: U1.5 41.91,50.8 42.55,50.16
  Bottom 0.813: R14.1 69.85,48.9 69.22,48.26 66.67,45.72 v66.67,43.18
PGD  (via drill 0.6 pad 1.42)
  Top 0.254: v97.16,45.72 v97.16,64.14
  Bottom 0.813: R36.1 R20.2 | J3.12 93.98,64.77 94.61,64.14 v97.16,64.14
  Bottom 1.016: R20.2 96.52,45.72 v97.16,45.72 J4.4
PGD_COMP
  Bottom 0.813: R20.1 86.36,44.45 Q5.1 81.28,44.45 R19.2
PGD_TGT  (via drill 0.6 pad 1.42)
  Top 0.254: v45.72,43.81 v68.58,43.81
  Bottom 0.406: 45.72,50.16 45.72,46.99 45.72,45.72 v45.72,43.81
  Bottom 0.61: U1.4 44.45,52.07 45.72,50.8 45.72,50.16
  Bottom 0.813: v68.58,43.81 R19.1
SW_PROGRAM
  Bottom 0.406: 45.72,53.98 45.72,57.53 45.72,57.78
  Bottom 0.61: U1.26 46.99,51.44 45.72,52.7 45.72,53.98 | 45.72,57.53 45.72,57.78 46.35,58.42 46.99,59.05 46.99,59.69 46.99,60.96 44.45,63.5 R33.1
USBD+
  Bottom 0.406: J1.3 9.06,53.17 10.16,52.07 12.06,52.07
  Bottom 0.61: 12.06,52.07 12.7,52.07 15.24,52.07 17.14,50.16 17.14,47.62 15.88,46.35 13.34,46.35 12.7,45.72 12.7,43.18 13.34,42.55 16.51,42.55 17.78,42.55 20.32,42.55 21.59,43.81 21.59,45.09 U1.16
USBD-
  Bottom 0.61: U1.15 19.05,52.07 17.78,53.34 11.08,53.34 J1.2
VDD  (via drill 0.6 pad 1.42)
  Top 0.254: v99.69,40.64 v99.69,60.33 | v83.82,62.23 v66.04,62.23
  Bottom 0.813: 101.6,40.64 J4.2 | D1.A R18.1 97.79,35.56 | 97.79,35.56 102.87,35.56 104.14,34.29 R13.2 105.41,30.48 105.41,23.5 D4.C 100.97,19.05 98.42,19.05 95.89,16.51 57.15,16.51 56.52,16.51 D7.C | v99.69,40.64 101.6,40.64 | v99.69,40.64 101.6,40.64 | v99.69,40.64 97.79,38.73 97.79,35.56 | J3.3 J3.4 83.82,62.87 | v83.82,62.23 83.82,62.87 | v83.82,62.23 83.82,62.87 | R26.2 65.41,61.59 v66.04,62.23 | v99.69,60.33 92.08,60.33 90.17,62.23 v83.82,62.23
VDD_ADJ
  Bottom 0.406: 22.86,46.35 22.86,50.16
  Bottom 0.61: U1.13 21.59,53.34 22.86,52.07 22.86,50.16 | R4.1 22.86,43.81 22.86,45.72 22.86,46.35
VDD_COMP
  Bottom 0.813: Q2.2 81.28,53.34 80.01,52.07 76.2,52.07 74.93,50.8 74.93,46.99 | 74.93,40.64 74.93,39.37 74.3,38.73 R17.1 | 74.93,40.64 74.93,46.99 | 74.93,46.99 Q3.2 | 74.93,40.64 79.38,40.64 80.64,40.64 | 80.64,40.64 Q5.2 | D1.C 87,38.1 85.72,36.83 83.19,36.83 80.64,39.37 80.64,40.64
VDD_FB
  Bottom 0.813: U1.3 46.99,57.15 48.26,58.42 48.9,59.05 48.9,59.69 48.9,60.96 49.53,61.59 R26.1
VDD_N  (via drill 0.6 pad 1.42)
  Top 0.254: v56.13,36.83 v76.2,36.83 | v41.91,45.09 v54.61,45.09
  Bottom 0.61: Q9.G 89.53,29.21 88.9,29.84 | 88.9,29.84 R12.1 | v41.91,45.09 U1.24 | 88.9,29.84 78.74,29.84 76.83,29.84 76.2,30.48 v76.2,36.83 | 54.61,38.73 54.61,38.35 54.61,38.73
  Bottom 0.813: v54.61,45.09 54.61,39.37 54.61,38.73 54.61,38.35 v56.13,36.83
VDD_P  (via drill 0.6 pad 1.42)
  Top 0.254: v63.5,35.56 v74.3,35.56 | v44.45,45.72 v56.52,45.72
  Bottom 0.406: 43.18,53.98 43.18,57.78
  Bottom 0.61: R16.2 84.45,26.67 83.82,26.67 | R30.1 82.55,21.59 83.82,22.86 83.82,26.04 83.82,26.67 | 83.82,26.67 83.82,27.94 83.19,28.57 75.56,28.57 74.3,29.84 74.3,34.29 v74.3,35.56 | v44.45,45.72 U1.25 44.45,50.16 43.18,51.44 43.18,53.98 | 43.18,57.78 43.18,58.42 41.91,59.69 R3.2
  Bottom 0.813: v56.52,45.72 56.52,43.81 60.33,40.01 63.5,36.83 v63.5,35.56
VDD_RAW  (via drill 0.6 pad 1.42)
  Top 0.254: v60.96,24.13 v79.38,24.13
  Bottom 0.813: R7.1 R5.2 40.64,24.77 41.27,24.13 45.72,24.13 Q1.D 58.42,25.4 59.69,25.4 v60.96,24.13 | C12.1 101.6,27.94 C11.+ 96.52,27.94 93.34,24.77 | v79.38,24.13 79.38,20.95 80.01,20.32 80.64,19.68 83.19,19.68 86.36,22.86 88.27,24.77 92.08,24.77 93.34,24.77 | 93.34,24.77 Q10.S
VDD_RAW_FB
  Bottom 0.813: U2.3 49.53,32.38 48.9,31.75 43.81,31.75 43.18,32.38 R6.1 R5.1
VDD_RAW_REF
  Bottom 0.61: C8.1 52.07,39.37 51.69,39.75 49.53,39.75 45.97,39.75 33.27,39.75 33.02,40.01 R4.2
  Bottom 0.813: C8.1 U2.2
VPP  (via drill 0.6 pad 1.42)
  Top 0.254: v101.6,38.1 v101.6,58.42
  Bottom 0.813: Q6.3 15.88,9.53 15.24,8.89 6.35,8.89 5.71,9.53 R28.1 | J4.1 v101.6,38.1 | J3.17 J3.18 101.6,64.77 v101.6,58.42 100.97,58.42 89.53,58.42 87.63,60.33 82.55,60.33 81.28,61.59 81.28,62.23 J3.2 J3.1
  Bottom 1.016: Q6.3 22.86,10.16 24.13,8.89 24.13,3.81 24.77,3.17 106.68,3.17 107.95,4.45 107.95,34.29 106.68,35.56 J4.1
VPP_FB  (via drill 0.6 pad 1.42)
  Top 0.254: v34.29,22.86 v34.29,41.4
  Bottom 0.61: v34.29,41.4 34.42,41.27 34.8,41.02 47.5,41.02 48.26,41.78 48.26,50.16 48.26,52.07 48.9,52.7 49.53,53.34 U1.2
  Bottom 0.813: R24.1 R22.2 v34.29,22.86
VPP_ON  (via drill 0.6 pad 1.42)
  Top 0.254: v33.02,19.05 33.02,41.91 v33.02,42.93
  Bottom 0.61: U1.23 39.37,44.2 38.1,42.93 v33.02,42.93
  Bottom 0.813: R27.1 31.75,16.51 33.02,17.78 v33.02,19.05
VPP_PUMP  (via drill 0.6 pad 1.42)
  Top 0.254: v14.61,38.73 v14.61,44.45
  Bottom 0.406: 20.32,46.35 20.32,50.04 20.32,54.1 20.32,57.02 20.32,57.4
  Bottom 0.61: U1.12 24.13,57.4 23.5,58.04 20.95,58.04 20.32,57.4 20.32,57.02 | 20.32,50.04 20.32,54.1
  Bottom 0.813: R21.1 28.57,33.66 26.67,35.56 17.78,35.56 v14.61,38.73 | 20.32,46.35 20.32,45.72 19.05,44.45 v14.61,44.45
VPP_PUMP_SW
  Bottom 0.813: 14.61,30.48 Q4.3
  Bottom 1.016: L1.1 14.61,30.48 12.06,30.48 D3.A
VPP_RAW
  Bottom 0.813: 8.26,21.59 8.26,24.13 8.26,33.02 10.16,33.02 | 8.26,21.59 R23.1 8.26,16.51 8.26,14.61 8.89,13.97 15.24,13.97 15.88,13.34 Q6.1 | 8.26,21.59 D3.C 12.06,22.86 R22.1
  Bottom 1.016: C15.+ 10.79,33.66 10.16,33.02 8.26,33.02 5.08,33.02 C9.1

### Text on the board
Bottom: PK2C 1.0
tDocu: PWR | BUSY | TGT | PROG | ADAPTER | VPP | VDD | VSS | PGC | VSS | PGDIQ | VSS | +5V | CS | VSS | ICSP | VPP | PROG | ICSP | VDD | AUX | VSS | NC | PGD | PGC | PGC | PGD | VSS | USB | VDD | VPP | 6-12VDC | + | - | EXT | PWR | ON | OFF | by Robson Martins (http://pk2c.robsonmartins.com) | EXT PWR | PK2C Programmer v.1.0